# Altium schematic sheet perifericos.SchDoc
size A4
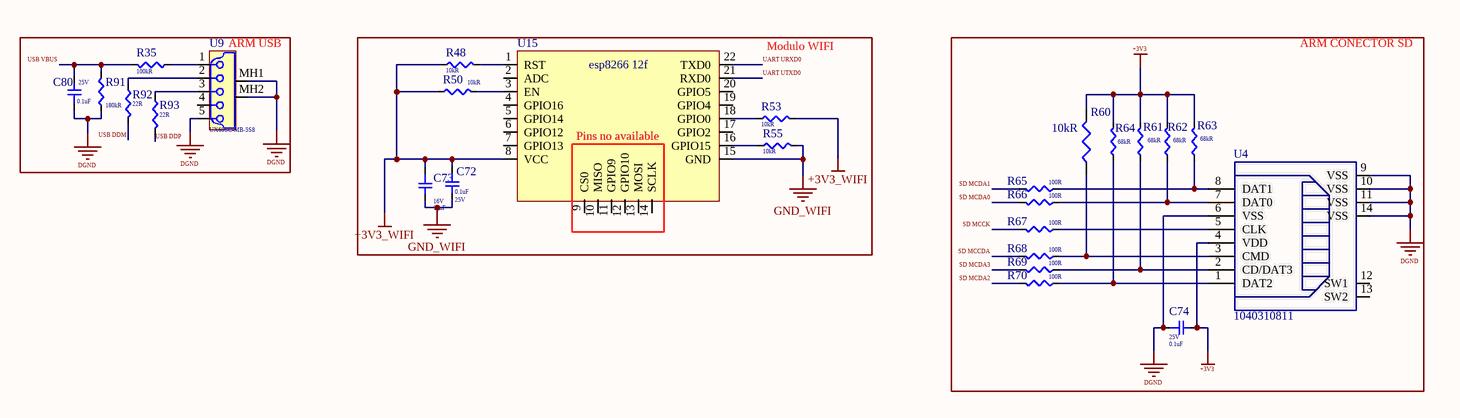
[diagram p0: perifericos.SchDoc]

## Parts
C72  Voltage Rating: 25V  Capacitance: 0.1uF  [CAP smd 0805 ok]  (hidden comment: CAP_CC0805KRX7R8BB104_YAGEO)
C73  Voltage Rating: 16V  Capacitance: 10uF  [CAP smd 0805 OK]  (hidden comment: CAP_CL21A106KOCL3RC)
C74  Voltage Rating: 25V  Capacitance: 0.1uF  [CAP smd 0805 ok]  (hidden comment: CAP_CC0805KRX7R8BB104_YAGEO)
C80  Voltage Rating: 25V  Capacitance: 0.1uF  [CAP smd 0805 ok]  (hidden comment: CAP_CC0805KRX7R8BB104_YAGEO)
R35  Resistance: 100kR  [res 0805 ok]  (hidden comment: AC0805JR-07100KL)
R48  Resistance: 10kR  [res 0805 ok]  (hidden comment: RC0805JR-0710KL)
R50  Resistance: 10kR  [res 0805 ok]  (hidden comment: RC0805JR-0710KL)
R53  Resistance: 10kR  [res 0805 ok]  (hidden comment: RC0805JR-0710KL)
R55  Resistance: 10kR  [res 0805 ok]  (hidden comment: RC0805JR-0710KL)
R60  Resistance: 10kR  [Res 1206 ok]  (hidden comment: RC1206JR-0768KL)
R61  Resistance: 68kR  [Res 1206 ok]  (hidden comment: RC1206JR-0768KL)
R62  Resistance: 68kR  [Res 1206 ok]  (hidden comment: RC1206JR-0768KL)
R63  Resistance: 68kR  [Res 1206 ok]  (hidden comment: RC1206JR-0768KL)
R64  Resistance: 68kR  [Res 1206 ok]  (hidden comment: RC1206JR-0768KL)
R65  Resistance: 100R  [Res 1206 ok]  (hidden comment: RC1206JR-07100RL)
R66  Resistance: 100R  [Res 1206 ok]  (hidden comment: RC1206JR-07100RL)
R67  Resistance: 100R  [Res 1206 ok]  (hidden comment: RC1206JR-07100RL)
R68  Resistance: 100R  [Res 1206 ok]  (hidden comment: RC1206JR-07100RL)
R69  Resistance: 100R  [Res 1206 ok]  (hidden comment: RC1206JR-07100RL)
R70  Resistance: 100R  [Res 1206 ok]  (hidden comment: RC1206JR-07100RL)
R91  Resistance: 180kR  [Res 1206 ok]  (hidden comment: RC1206JR-07180KL)
R92  Resistance: 22R  [res 0805 ok]  (hidden comment: RC0805JR-0722RL)
R93  Resistance: 22R  [res 0805 ok]  (hidden comment: RC0805JR-0722RL)
U4  1040310811  [micro sd]
U9  UX60SC-MB-5S8
U15  esp8266 12f  [modulo wifi ok]

## Blocks framed on the sheet
ARM USB: C80 R35 R91-R93 U9
Modulo WIFI: C72 C73 R48 R50 R53 R55 U15
ARM CONECTOR SD: C74 R60-R70 U4

## Nets
+3V3: C74.22 R60.1 R61.1 R62.1 R63.1 R64.1 U4.4(VDD)
+3V3_WIFI: C72.23 C73.23 R48.2 R50.2 R53.1 U15.8(VCC)
DGND: C74.23 C80.23 R91.2 U4.6(VSS) U4.9(VSS) U4.10(VSS) U4.11(VSS) U4.14(VSS) U9.5 U9.MH1 U9.MH2
GND_WIFI: C72.22 C73.22 R55.1 U15.15(GND)
SD MCCDA: R68.1
SD MCCK: R67.1
SD MCDA0: R66.1
SD MCDA1: R65.1
SD MCDA2: R70.1
SD MCDA3: R69.1
UART URXD0: U15.22(TXD0)
UART UTXD0: U15.21(RXD0)
USB DDM: R92.1
USB DDP: R93.1
USB VBUS: C80.22 R35.2 R91.1
NetR35_1: R35.1 U9.1
NetR48_1: R48.1 U15.1(RST)
NetR50_1: R50.1 U15.3(EN)
NetR53_2: R53.2 U15.18(GPIO0)
NetR55_2: R55.2 U15.16(GPIO15)
NetR60_2: R60.2 R68.2 U4.3(CMD)
NetR61_2: R61.2 R69.2 U4.2(CD/DAT3)
NetR62_2: R62.2 R66.2 U4.7(DAT0)
NetR63_2: R63.2 R65.2 U4.8(DAT1)
NetR64_2: R64.2 R70.2 U4.1(DAT2)
NetR67_2: R67.2 U4.5(CLK)
NetR92_2: R92.2 U9.2
NetR93_2: R93.2 U9.3

Not connected (* = marked no-connect by the designer): U4 12(SW1) 13(SW2); U9 4; U15 2(ADC) 4(GPIO16) 5(GPIO14) 6(GPIO12) 7(GPIO13) 9(CS0) 10(MISO) 11(GPIO9) 12(GPIO10) 13(MOSI) 14(SCLK) 17(GPIO2) 19(GPIO4) 20(GPIO5)

## Notes on the sheet
- (in symbol esp8266 12f) Pins no available

## Library data of the parts
C72 C74 C80 = CAP_CC0805KRX7R8BB104_YAGEO: CAPACITOR, 0805, 100NF, 25V, REEL 4000; Manufacturer 1: Yageo; Material: Ceramic; Tolerance: 10%; Dielectric: X7R; Insulation Resistance: 100GR; Supplier 1: Digi-Key; Manufacturer Part Number 1: CC0805KRX7R8BB104; Stock 1: 278639; Pricing 1: 1=0,12000, 10=0,08800, 50=0,04980, 100=0,04130, 500=0,02894, 1000=0,02396 (USD); RoHS: Yes; Mount: Surface Mount; Case/Package: 0805; Number of Pins: 2; Case Code (Metric): 2012; Case Code (Imperial): 0805; Min Operating Temperature: -55°C; Max Operating Temperature: 125°C; Package Quantity: 1; Packaging: Tape and Reel; Voltage Rating (DC): 25V; Termination: SMD/SMT; Resistor Type: Ceramic; Series: CC; Length: 2mm; Width: 0.049inch; Height: 0.85mm; Thickness: 0.033inch; Depth: 1.25mm; Radiation Hardening: No; REACH SVHC: No SVHC; Lead Free: Lead Free; Halogen Free: Halogen Free; RoHS Compliant: Yes; ComponentLink1URL: https://datasheet.ciiva.com/8034/70765-8034031.pdf?src-supplier=Element14; ComponentLink1Description: https://datasheet.ciiva.com/8034/70765-8034031.pdf?src-supplier=Element14; ComponentLink2URL: https://datasheet.ciiva.com/28450/1489800-28450789.pdf?src-supplier=Element14; ComponentLink2Description: https://datasheet.ciiva.com/28450/1489800-28450789.pdf?src-supplier=Element14; ComponentLink3URL: https://datasheet.ciiva.com/46430/1850775-46430166.pdf?src-supplier=Element14; ComponentLink3Description: https://datasheet.ciiva.com/46430/1850775-46430166.pdf?src-supplier=Element14; ComponentLink4URL: https://datasheet.ciiva.com/145/mlccorderingcode-145008.pdf?src-supplier=Digi-Key; ComponentLink4Description: https://datasheet.ciiva.com/145/mlccorderingcode-145008.pdf?src-supplier=Digi-Key; ComponentLink5URL: https://datasheet.ciiva.com/145/mlccorderingcode-145007.pdf?src-supplier=Digi-Key; ComponentLink5Description: https://datasheet.ciiva.com/145/mlccorderingcode-145007.pdf?src-supplier=Digi-Key; ComponentLink6URL: https://datasheet.ciiva.com/145/mlccorderingcode-145009.pdf?src-supplier=Digi-Key; ComponentLink6Description: https://datasheet.ciiva.com/145/mlccorderingcode-145009.pdf?src-supplier=Digi-Key; ComponentLink7URL: https://datasheet.ciiva.com/8034/1784427-8034030.pdf?src-supplier=Element14; ComponentLink7Description: https://datasheet.ciiva.com/8034/1784427-8034030.pdf?src-supplier=Element14; ComponentLink8URL: https://datasheet.ciiva.com/8034/1784427-8034029.pdf?src-supplier=Element14; ComponentLink8Description: https://datasheet.ciiva.com/8034/1784427-8034029.pdf?src-supplier=Element14; ComponentLink9URL: https://datasheet.ciiva.com/15189/getdatasheetpartid-330244-15189223.pdf?src-supplier=Verical; ComponentLink9Description: https://datasheet.ciiva.com/15189/getdatasheetpartid-330244-15189223.pdf?src-supplier=Verical; ComponentLink10URL: https://datasheet.ciiva.com/16625/upy-gphc-x7r-6-3v-to-50v-8-16625546.pdf?src-supplier=Avnet+Europe; ComponentLink10Description: https://datasheet.ciiva.com/16625/upy-gphc-x7r-6-3v-to-50v-8-16625546.pdf?src-supplier=Avnet+Europe; Supplier Part Number 1: 311-1141-1-ND
C73 = CAP_CL21A106KOCL3RC: CAP CER 10UF 16V X5R 0805; Manufacturer 1: Samsung; Tolerance: 10%; Supplier 1: Digi-Key; Manufacturer Part Number 1: CL21A106KOCL3RC; Stock 1: 0; RoHS: Yes; Mount: Surface Mount; Case/Package: 0805; Case Code (Metric): 2012; Case Code (Imperial): 0805; Min Operating Temperature: -55°C; Max Operating Temperature: 85°C; Package Quantity: 1; Packaging: Tape and Reel; Series: CL; Length: 0.079inch; Width: 0.049inch; Thickness: 0.037inch; RoHS Compliant: Yes; ComponentLink1URL: https://datasheet.ciiva.com/25796/cl21a106kocl3rc-25796224.pdf?src-supplier=Digi-Key; ComponentLink1Description: https://datasheet.ciiva.com/25796/cl21a106kocl3rc-25796224.pdf?src-supplier=Digi-Key; Supplier Part Number 1: 1276-2398-2-ND
R35 = AC0805JR-07100KL: Thick Film Resistors - SMD 0805  100K ohm 5% 1/8W; Manufacturer 1: Yageo; Power Rating: 125mW; Voltage Rating: 150V; Temperature Coefficient: 100ppm/°C; Supplier 1: Digi-Key; Manufacturer Part Number 1: AC0805JR-07100KL; Stock 1: 23; Pricing 1: 1=0,10000, 10=0,04300, 100=0,01730, 1000=0,00777, 2500=0,00674 (USD); RoHS: Yes; Case/Package: 0805; Case Code (Imperial): 0805; Case Code (Metric): 2012; Weight: 0.000194oz; Min Operating Temperature: -55°C; Max Operating Temperature: 155°C; Tolerance: 5%; Packaging: Tape and Reel; Resistor Type: Thick Film; Number of Terminations: 2; Termination: SMD/SMT; Max Power Dissipation: 125mW; Features: Moisture Resistant,Automotive AEC-Q200; Series: AC; Length: 0.079inch; Width: 0.049inch; Height: 0.024inch; RoHS Compliant: Yes; ComponentLink1URL: https://datasheet.ciiva.com/12576/pyu-ac-51-rohs-l-2-12576604.pdf?src-supplier=Mouser; ComponentLink1Description: https://datasheet.ciiva.com/12576/pyu-ac-51-rohs-l-2-12576604.pdf?src-supplier=Mouser; Supplier Part Number 1: YAG3756CT-ND
R48 R50 R53 R55 = RC0805JR-0710KL: Res Thick Film smd 0805 10K Ohm 5% 1/8W; Manufacturer 1: Yageo; Power Rating: 125mW; Temperature Coefficient: 100ppm/°C; Voltage Rating: 150V; Supplier 1: Digi-Key; Manufacturer Part Number 1: RC0805JR-0710KL; Stock 1: 2124400; Pricing 1: 1=0,10000, 10=0,03600, 100=0,01450, 1000=0,00652, 2500=0,00566 (USD); RoHS: Yes; Case/Package: 0805; Contact Plating: Tin,Matte; Case Code (Imperial): 0805; Case Code (Metric): 2012; Size Code: 0805; Min Operating Temperature: -55°C; Max Operating Temperature: 155°C; Resistor Type: Thick Film; Tolerance: 5%; Packaging: Tape and Reel; Termination: SMD/SMT; Features: Moisture Resistant; Series: RC; Max Power Dissipation: 125mW; Number of Terminations: 2; Resistance Tolerance: 5%; Construction: Rectangular; Length: 2mm; Width: 1.25mm; Height: 0.5mm; Depth: 1.25mm; Radiation Hardening: No; RoHS Compliant: Yes; REACH SVHC: Unknown; Military Standard: Not; Lead Free: Lead Free; ComponentLink1URL: https://datasheet.ciiva.com/7941/444164-7941870.pdf?src-supplier=Element14; ComponentLink1Description: https://datasheet.ciiva.com/7941/444164-7941870.pdf?src-supplier=Element14; ComponentLink2URL: https://datasheet.ciiva.com/7941/444164-7941871.pdf?src-supplier=Element14; ComponentLink2Description: https://datasheet.ciiva.com/7941/444164-7941871.pdf?src-supplier=Element14; ComponentLink3URL: https://datasheet.ciiva.com/7983/444164-7983765.pdf?src-supplier=Element14; ComponentLink3Description: https://datasheet.ciiva.com/7983/444164-7983765.pdf?src-supplier=Element14; Supplier Part Number 1: 311-10KARCT-ND
R60 = RC1206FR-0710KL: Res Thick Film smd 1206 10K Ohm 1% 0.25W(1/4W); Manufacturer 1: Yageo; Power Rating: 250mW; Voltage Rating: 200V; Temperature Coefficient: 100ppm/°C; Supplier 1: Digi-Key; Manufacturer Part Number 1: RC1206FR-0710KL; Stock 1: 845388; Pricing 1: 1=0,10000, 10=0,07400, 100=0,03010, 1000=0,01353, 2500=0,01174 (USD); RoHS: Yes; Case/Package: 1206; Case Code (Imperial): 1206; Case Code (Metric): 3216; Size Code: 1206; Min Operating Temperature: -55°C; Max Operating Temperature: 155°C; Tolerance: 1%; Packaging: Tape and Reel; Termination: SMD/SMT; Resistor Type: Thick Film; Series: RC; Resistance Tolerance: 1%; Features: Moisture Resistant; Max Power Dissipation: 250mW; Number of Terminations: 2; Construction: Rectangular; Package Quantity: 5000; Length: 3.1mm; Width: 1.6mm; Height: 0.55mm; Depth: 1.6mm; REACH SVHC: Unknown; Lead Free: Lead Free; RoHS Compliant: Yes; Military Standard: Not; ComponentLink1URL: https://datasheet.ciiva.com/7857/1692832-7857244.pdf?src-supplier=Element14; ComponentLink1Description: https://datasheet.ciiva.com/7857/1692832-7857244.pdf?src-supplier=Element14; ComponentLink2URL: https://datasheet.ciiva.com/7857/1692832-7857245.pdf?src-supplier=Element14; ComponentLink2Description: https://datasheet.ciiva.com/7857/1692832-7857245.pdf?src-supplier=Element14; ComponentLink3URL: https://datasheet.ciiva.com/46445/444357-46445703.pdf?src-supplier=Element14; ComponentLink3Description: https://datasheet.ciiva.com/46445/444357-46445703.pdf?src-supplier=Element14; Supplier Part Number 1: 311-10.0KFRCT-ND
R61-R64 = RC1206JR-0768KL: Thick Film Resistors smd 1206(3216) 68K OHM 5% 250mW; Manufacturer 1: Yageo; Voltage Rating: 200V; Temperature Coefficient: 100ppm/°C; Supplier 1: Digi-Key; Manufacturer Part Number 1: RC1206JR-0768KL; Stock 1: 38664; Pricing 1: 1=0,10000, 10=0,06300, 100=0,02580, 1000=0,01158, 2500=0,01005 (USD); RoHS: Yes; Case/Package: 1206; Case Code (Imperial): 1206; Case Code (Metric): 3216; Size Code: 1206; Min Operating Temperature: -55°C; Max Operating Temperature: 155°C; Tolerance: 5%; Power Rating: 250mW; Packaging: Tape and Reel; Termination: SMD/SMT; Resistor Type: Thick Film; Features: Moisture Resistant; Series: RC; Max Power Dissipation: 250mW; Number of Terminations: 2; Resistance Tolerance: 5%; Construction: Rectangular; Length: 3.1mm; Depth: 1.6mm; REACH SVHC: No SVHC; Military Standard: Not; Lead Free: Lead Free; RoHS Compliant: Yes; ComponentLink1URL: https://datasheet.ciiva.com/7857/444357-7857527.pdf?src-supplier=Element14; ComponentLink1Description: https://datasheet.ciiva.com/7857/444357-7857527.pdf?src-supplier=Element14; ComponentLink2URL: https://datasheet.ciiva.com/7857/444357-7857528.pdf?src-supplier=Element14; ComponentLink2Description: https://datasheet.ciiva.com/7857/444357-7857528.pdf?src-supplier=Element14; Supplier Part Number 1: 311-68KERCT-ND
R65-R70 = RC1206JR-07100RL: Thick Film Resistors SMD 1206 (3264)  100 OHM 5% 250mW; Manufacturer 1: Yageo; Temperature Coefficient: 100ppm/°C; Voltage Rating: 200V; Supplier 1: Digi-Key; Manufacturer Part Number 1: RC1206JR-07100RL; Stock 1: 1229853; Pricing 1: 1=0,10000, 10=0,06300, 100=0,02580, 1000=0,01158, 2500=0,01005 (USD); RoHS: Yes; Case/Package: 1206; Case Code (Metric): 3216; Case Code (Imperial): 1206; Size Code: 1206; Min Operating Temperature: -55°C; Max Operating Temperature: 155°C; Tolerance: 5%; Resistor Type: Thick Film; Packaging: Tape and Reel; Package Quantity: 5000; Power Rating: 250mW; Number of Terminations: 2; Termination: SMD/SMT; Max Power Dissipation: 250mW; Series: RC1206; Resistance Tolerance: 5%; Construction: Rectangular; Length: 0.122inch; Width: 0.063inch; Height: 0.026inch; Depth: 1.6mm; REACH SVHC: Unknown; Lead Free: Lead Free; Military Standard: Not; RoHS Compliant: Yes; ComponentLink1URL: https://datasheet.ciiva.com/29181/402427-da-01-en-smd-widerstand-chip1206-100-ohm-29181432.pdf?src-supplier=Conrad; ComponentLink1Description: https://datasheet.ciiva.com/29181/402427-da-01-en-smd-widerstand-chip1206-100-ohm-29181432.pdf?src-supplier=Conrad; ComponentLink2URL: https://datasheet.ciiva.com/2458/pyu-rc1206-51-rohs-l-4-2458710.pdf?src-supplier=Digi-Key; ComponentLink2Description: https://datasheet.ciiva.com/2458/pyu-rc1206-51-rohs-l-4-2458710.pdf?src-supplier=Digi-Key; ComponentLink3URL: https://datasheet.ciiva.com/2458/pyu-rc1206-51-rohs-l-4-2458711.pdf?src-supplier=Digi-Key; ComponentLink3Description: https://datasheet.ciiva.com/2458/pyu-rc1206-51-rohs-l-4-2458711.pdf?src-supplier=Digi-Key; ComponentLink4URL: https://datasheet.ciiva.com/2458/pyu-rc1206-51-rohs-l-4-2458712.pdf?src-supplier=Digi-Key; ComponentLink4Description: https://datasheet.ciiva.com/2458/pyu-rc1206-51-rohs-l-4-2458712.pdf?src-supplier=Digi-Key; ComponentLink5URL: https://datasheet.ciiva.com/16772/pyu-rc1206-51-rohs-l-4-16772235.pdf?src-supplier=Future+Electronics; ComponentLink5Description: https://datasheet.ciiva.com/16772/pyu-rc1206-51-rohs-l-4-16772235.pdf?src-supplier=Future+Electronics; Supplier Part Number 1: 311-100ERCT-ND
R91 = RC1206JR-07180KL: RES SMD 1206 180K OHM 5% 1/4W; Manufacturer 1: Yageo; Power Rating: 250mW; Voltage Rating: 200V; Temperature Coefficient: 100ppm/°C; Supplier 1: Newark; Manufacturer Part Number 1: RC1206JR-07180KL; Stock 1: 23350; Pricing 1: 10=0,03100, 25=0,02500, 50=0,01800, 100=0,01100 (USD); RoHS: Yes; Case/Package: 1206; Case Code (Imperial): 1206; Case Code (Metric): 3216; Size Code: 1206; Min Operating Temperature: -55°C; Max Operating Temperature: 155°C; Resistor Type: Thick Film; Tolerance: 5%; Package Quantity: 1; Packaging: Tape and Reel; Termination: SMD/SMT; Number of Terminations: 2; Max Power Dissipation: 250mW; Voltage Rating (DC): 200V; Features: Moisture Resistant; Series: RC; Construction: Rectangular; Length: 3.1mm; Width: 1.6mm; Height: 0.026inch; Depth: 1.6mm; Military Standard: Not; Lead Free: Lead Free; RoHS Compliant: Yes; ComponentLink1URL: https://datasheet.ciiva.com/29181/402818-da-01-en-smd-widerstand-chip1206-180-kohm-29181400.pdf?src-supplier=Conrad; ComponentLink1Description: https://datasheet.ciiva.com/29181/402818-da-01-en-smd-widerstand-chip1206-180-kohm-29181400.pdf?src-supplier=Conrad; ComponentLink2URL: https://datasheet.ciiva.com/2458/pyu-r-int-thick-7-2458890.pdf?src-supplier=Digi-Key; ComponentLink2Description: https://datasheet.ciiva.com/2458/pyu-r-int-thick-7-2458890.pdf?src-supplier=Digi-Key; ComponentLink3URL: https://datasheet.ciiva.com/2458/pyu-r-int-thick-7-2458891.pdf?src-supplier=Digi-Key; ComponentLink3Description: https://datasheet.ciiva.com/2458/pyu-r-int-thick-7-2458891.pdf?src-supplier=Digi-Key; ComponentLink4URL: https://datasheet.ciiva.com/2458/pyu-r-int-thick-7-2458892.pdf?src-supplier=Digi-Key; ComponentLink4Description: https://datasheet.ciiva.com/2458/pyu-r-int-thick-7-2458892.pdf?src-supplier=Digi-Key; ComponentLink5URL: https://datasheet.ciiva.com/17053/pyu-rc1206-51-rohs-l-4-17053351.pdf?src-supplier=Future+Electronics; ComponentLink5Description: https://datasheet.ciiva.com/17053/pyu-rc1206-51-rohs-l-4-17053351.pdf?src-supplier=Future+Electronics; Supplier Part Number 1: 82AH8580
R92 R93 = RC0805JR-0722RL: Res Thick Film smd  0805 22 Ohm 5% 1/8W; Manufacturer 1: Yageo; Temperature Coefficient: 100ppm/°C; Power Rating: 125mW; Voltage Rating: 150V; Supplier 1: Digi-Key; Manufacturer Part Number 1: RC0805JR-0722RL; Stock 1: 938847; Pricing 1: 1=0,10000, 10=0,03600, 100=0,01450, 1000=0,00652, 2500=0,00566 (USD); RoHS: Yes; Case/Package: 0805; Contact Plating: Tin,Matte,Lead; Case Code (Imperial): 0805; Case Code (Metric): 2012; Size Code: 0805; Min Operating Temperature: -55°C; Max Operating Temperature: 155°C; Tolerance: 5%; Resistor Type: Thick Film; Packaging: Tape and Reel; Termination: SMD/SMT; Features: Moisture Resistant; Series: RC; Max Power Dissipation: 125mW; Number of Terminations: 2; Resistance Tolerance: 5%; Construction: Rectangular; Length: 2mm; Depth: 1.25mm; Radiation Hardening: No; REACH SVHC: Unknown; Military Standard: Not; Lead Free: Lead Free; ComponentLink1URL: http://www.mouser.com/ds/2/447/Yageo_08112016_RC0805-968729.pdf?src-supplier=Mouser; ComponentLink1Description: http://www.mouser.com/ds/2/447/Yageo_08112016_RC0805-968729.pdf?src-supplier=Mouser; ComponentLink2URL: http://www.farnell.com/datasheets/2167052.pdf?src-supplier=Farnell; ComponentLink2Description: http://www.farnell.com/datasheets/2167052.pdf?src-supplier=Farnell; ComponentLink3URL: http://components.arrow.com/part/dataview/0323_00047573?src-supplier=Arrow+Europe; ComponentLink3Description: http://components.arrow.com/part/dataview/0323_00047573?src-supplier=Arrow+Europe; ComponentLink4URL: http://www.farnell.com/datasheets/444164.pdf?src-supplier=Farnell; ComponentLink4Description: http://www.farnell.com/datasheets/444164.pdf?src-supplier=Farnell; ComponentLink5URL: http://www.yageo.com/documents/recent/PYu-RC_Group_51_RoHS_L_10.pdf?src-supplier=Digi-Key; ComponentLink5Description: http://www.yageo.com/documents/recent/PYu-RC_Group_51_RoHS_L_10.pdf?src-supplier=Digi-Key; ComponentLink6URL: http://www.yageo.com/documents/recent/PYu-RC_Group_51_RoHS_L_9.pdf?src-supplier=Digi-Key; ComponentLink6Description: http://www.yageo.com/documents/recent/PYu-RC_Group_51_RoHS_L_9.pdf?src-supplier=Digi-Key; ComponentLink7URL: http://www.yageo.com/pdf/PYu-RC0805_51_RoHS_L_4.pdf?src-supplier=Avnet; ComponentLink7Description: http://www.yageo.com/pdf/PYu-RC0805_51_RoHS_L_4.pdf?src-supplier=Avnet; ComponentLink8URL: http://www.yageo.com/documents/recent/PYu-RC0805_51_RoHS_L_5.pdf?src-supplier=Avnet+Europe; ComponentLink8Description: http://www.yageo.com/documents/recent/PYu-RC0805_51_RoHS_L_5.pdf?src-supplier=Avnet+Europe; ComponentLink9URL: http://www.farnell.com/datasheets/442941.pdf?src-supplier=Element14; ComponentLink9Description: http://www.farnell.com/datasheets/442941.pdf?src-supplier=Element14; ComponentLink10URL: http://www.yageo.ru/pdf/RC0805.pdf?src-supplier=Future+Electronics; ComponentLink10Description: http://www.yageo.ru/pdf/RC0805.pdf?src-supplier=Future+Electronics; ComponentLink11URL: http://www.farnell.com/datasheets/2167052.pdf?src-supplier=Newark; ComponentLink11Description: http://www.farnell.com/datasheets/2167052.pdf?src-supplier=Newark; ComponentLink12URL: http://www.farnell.com/datasheets/444164.pdf?src-supplier=Element14; ComponentLink12Description: http://www.farnell.com/datasheets/444164.pdf?src-supplier=Element14; Supplier Part Number 1: 311-22ARCT-ND
U4 = 1040310811: 1.10mm Pitch microSD Memory Card Connector, Surface Mount, Push-Pull Type, 1.42mm Height, with Detect Switch; Manufacturer 1: Molex; Number of Contacts: 8; Current Rating: 500mA; Voltage Rating (AC): 10V; Mating Cycles: 10000; Gender: Female; Pitch: 1.1mm; Supplier 1: Digi-Key; Stock 1: 24019; Pricing 1: 1=2,12000, 10=1,80700, 100=1,49270, 1000=1,17842 (USD); RoHS: Yes; Mount: Standard,Surface Mount; Contact Material: Bronze; Contact Plating: Gold; Housing Material: Polymer; Min Operating Temperature: -25°C; Max Operating Temperature: 85°C; Number of Rows: 1; Orientation: Right Angle; Packaging: Tape and Reel; Package Quantity: 1; Termination: Solder; Connector Type: Connector; Number of Circuits: 8; Series: 104031; Length: 11.14mm; Width: 11.4mm; Height: 1.42mm; Depth: 11.4mm; Radiation Hardening: No; REACH SVHC: Unknown; Halogen Free: Low Halogen; ComponentLink1URL: https://datasheet.ciiva.com/16655/1040310811-memory-card-socket-16655292.pdf?src-supplier=Avnet+Europe; ComponentLink1Description: https://datasheet.ciiva.com/16655/1040310811-memory-card-socket-16655292.pdf?src-supplier=Avnet+Europe; ComponentLink2URL: https://datasheet.ciiva.com/4581/1040310811-memory-card-socket-153593-4581012.pdf?src-supplier=Mouser; ComponentLink2Description: https://datasheet.ciiva.com/4581/1040310811-memory-card-socket-153593-4581012.pdf?src-supplier=Mouser; ComponentLink3URL: https://datasheet.ciiva.com/683/1040310811-sd-683579.pdf?src-supplier=Digi-Key; ComponentLink3Description: https://datasheet.ciiva.com/683/1040310811-sd-683579.pdf?src-supplier=Digi-Key; ComponentLink4URL: https://datasheet.ciiva.com/3121/1040310811-memory-card-socket-3121437.pdf?src-supplier=Avnet; ComponentLink4Description: https://datasheet.ciiva.com/3121/1040310811-memory-card-socket-3121437.pdf?src-supplier=Avnet; ComponentLink5URL: https://datasheet.ciiva.com/15174/getdatasheetpartid-716154-15174887.pdf?src-supplier=Verical; ComponentLink5Description: https://datasheet.ciiva.com/15174/getdatasheetpartid-716154-15174887.pdf?src-supplier=Verical; ComponentLink6URL: https://datasheet.ciiva.com/16496/1040310811-memory-card-socket-16496702.pdf?src-supplier=Avnet+Asia; ComponentLink6Description: https://datasheet.ciiva.com/16496/1040310811-memory-card-socket-16496702.pdf?src-supplier=Avnet+Asia; ComponentLink7URL: https://datasheet.ciiva.com/683/1040310811-sd-683580.pdf?src-supplier=Digi-Key; ComponentLink7Description: https://datasheet.ciiva.com/683/1040310811-sd-683580.pdf?src-supplier=Digi-Key; ComponentLink8URL: https://datasheet.ciiva.com/683/1040310811-sd-683581.pdf?src-supplier=Digi-Key; ComponentLink8Description: https://datasheet.ciiva.com/683/1040310811-sd-683581.pdf?src-supplier=Digi-Key; Manufacturer Part Number 1: 1040310811; Supplier Part Number 1: WM6357CT-ND
U9 = UX60SC-MB-5S8: Conn Mini USB 2.0 Type B RCP 5 POS 0.8mm Solder RA SMD 5 Terminal 1 Port Embossed T/R; Manufacturer 1: Hirose; Number of Terminals/Pins: 5; Gender: Receptacle; Connector Type: USB,Receptacle; Current Rating: 1A; Number of Ports: 1; Insulation Resistance: 100MR; Max Voltage Rating (AC): 5V; USB Standard: USB 2.0; Supplier 1: Digi-Key; Manufacturer Part Number 1: UX60SC-MB-5S8; Stock 1: 15275; Pricing 1: 1=0,99000, 10=0,86700, 25=0,81600, 50=0,78200, 100=0,74800, 250=0,68000, 500=0,61200 (USD); RoHS: Yes; Mount: Surface Mount,Horizontal,Through Hole; Contact Material: Copper Alloy,Copper; Contact Plating: Gold; Min Operating Temperature: -30°C; Max Operating Temperature: 75°C; Package Quantity: 1000; Packaging: Tape and Reel; Number of Contacts: 5; Termination: Solder; Orientation: Right Angle; Series: UX60S; Number of Rows: 1; Max Current Rating: 1A; Number of Positions: 5; Length: 7.7mm; Pitch: 0.8mm; Depth: 7mm; REACH SVHC: No SVHC; Lead Free: Lead Free; ComponentLink1URL: https://datasheet.ciiva.com/22666/1693469-22666928.pdf?src-supplier=Element14; ComponentLink1Description: https://datasheet.ciiva.com/22666/1693469-22666928.pdf?src-supplier=Element14; ComponentLink2URL: https://datasheet.ciiva.com/4598/ed-ux-20140717-4598805.pdf?src-supplier=Mouser; ComponentLink2Description: https://datasheet.ciiva.com/4598/ed-ux-20140717-4598805.pdf?src-supplier=Mouser; ComponentLink3URL: https://datasheet.ciiva.com/15181/getdatasheetpartid-457316-15181367.pdf?src-supplier=Verical; ComponentLink3Description: https://datasheet.ciiva.com/15181/getdatasheetpartid-457316-15181367.pdf?src-supplier=Verical; Supplier Part Number 1: H11589CT-ND